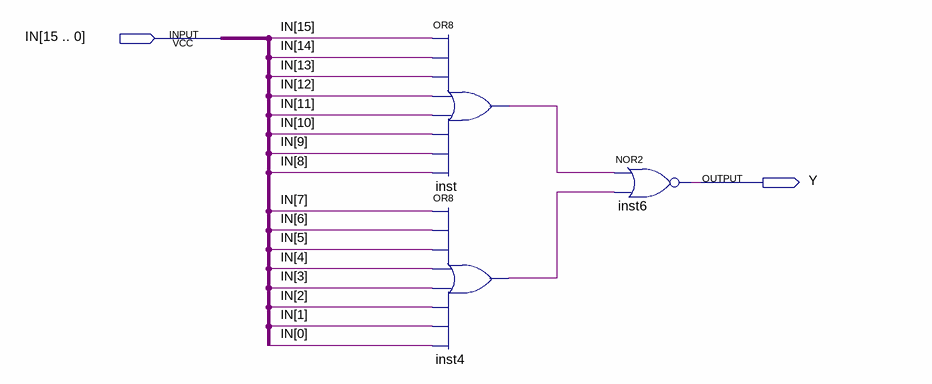
[diagram p0: schematic sheet]
// Quartus schematic ON_When_16_Zeros.bdf as structural Verilog: 3 symbols, 2 pins
module ON_When_16_Zeros (
  input  [15:0] IN,
  output Y
);

  wire inst4_out, inst_out;

  or inst (inst_out, IN[15], IN[14], IN[13], IN[12], IN[11], IN[10], IN[9], IN[8]);
  or inst4 (inst4_out, IN[7], IN[6], IN[5], IN[4], IN[3], IN[2], IN[1], IN[0]);
  nor inst6 (Y, inst_out, inst4_out);
endmodule
